# Altium schematic sheet Screen Driver.SchDoc: Graphics Driver PCB (part 1 of 3)
size A4; CompanyName: Concordia FSAE; DrawnBy: Ricky Lopez
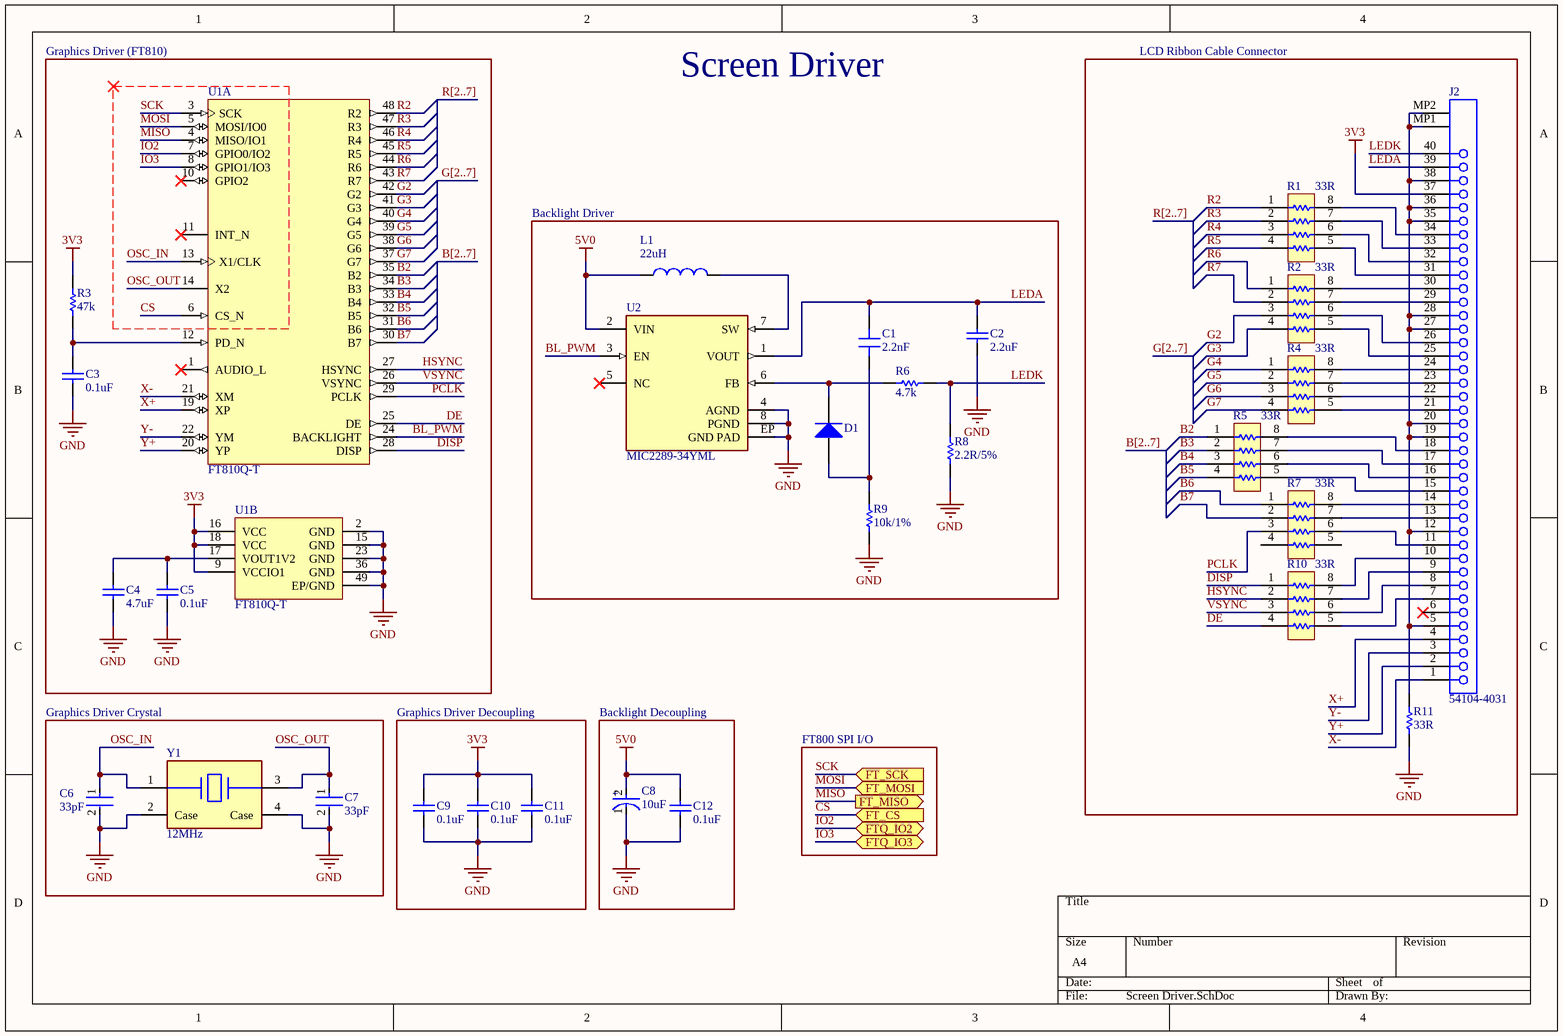
[diagram p0: Screen Driver.SchDoc]

## Parts
C1  2.2nF  [0805]
C2  2.2uF  [CAPC3225X270X30ML30]
C3  0.1uF  [CAPC2013X88X50NL20T25]
C4  4.7uF  [CAPC2113X120X50LL20T30]
C5  0.1uF  [CAPC2013X88X50NL20T25]
C6  33pF  [FP-CL21-IPC_B]
C7  33pF  [FP-CL21-IPC_B]
C8  10uF  [FP-T491C-MFG]
C9  0.1uF  [CAPC2013X88X50NL20T25]
C10  0.1uF  [CAPC2013X88X50NL20T25]
C11  0.1uF  [CAPC2013X88X50NL20T25]
C12  0.1uF  [CAPC2013X88X50NL20T25]
D1  1N4148WS-7-F  [DIOD-SOD323-2-A_V]  (value not drawn)
J2  54104-4031  [MOLX-54104-4031]
L1  22uH  [*INDC2012X145N]
R1  33R  [PNSC-EXB-38V103JV-8_M]
R2  33R  [PNSC-EXB-38V103JV-8_M]
R3  47k  [0805]
R4  33R  [PNSC-EXB-38V103JV-8_M]
R5  33R  [PNSC-EXB-38V103JV-8_M]
R6  4.7k  [0805]
R7  33R  [PNSC-EXB-38V103JV-8_M]
R8  2.2R/5%  [0805]
R9  10k/1%  [0805]
R10  33R  [PNSC-EXB-38V103JV-8_M]
R11  33R  [0805]
U1  FT810Q-T  [VQFN-48_5.2x5.2EP]  (parts A,B of 2)
U2  Part Number: MIC2289-34YML  [MIC2289]  (hidden comment: MIC2289)
Y1  12MHz  [FP-FL1200112-MFG]

## Blocks framed on the sheet
Graphics Driver (FT810): C3-C5 R3 U1
LCD Ribbon Cable Connector: J2 R1 R2 R4 R5 R7 R10 R11
Backlight Driver: C1 C2 D1 L1 R6 R8 R9 U2
Graphics Driver Crystal: C6 C7 Y1
Graphics Driver Decoupling: C9-C11
Backlight Decoupling: C8 C12

## Ports
FT_CS (in), FT_MISO (out), FT_MOSI (in), FT_SCK (in), FTQ_IO2 (bidir), FTQ_IO3 (bidir)

## Nets
3V3: C9.2 C10.2 C11.2 J2.37 R3.2 U1.9(VCCIO1) U1.16(VCC) U1.18(VCC)
5V0: C8.2(A) C12.2 L1.1 U2.2(VIN)
GND: C2.1 C3.1 C4.1 C5.1 C6.2 C7.2 C8.1(C) C9.1 C10.1 C11.1 C12.1 R8.2 R9.1 R11.1 U1.2(GND) U1.15(GND) U1.23(GND) U1.36(GND) U1.49(EP/GND) U2.4(AGND) U2.8(PGND) U2.EP(GND_PAD) Y1.2(Case) Y1.4(Case)
B2: R5.1 U1.35(B2)
B3: R5.2 U1.34(B3)
B4: R5.3 U1.33(B4)
B5: R5.4 U1.32(B5)
B6: R7.1 U1.31(B6)
B7: R7.2 U1.30(B7)
BL_PWM: U1.24(BACKLIGHT) U2.3(EN)
CS: U1.6(CS_N) ; port FT_CS
DE: R10.4 U1.25(DE)
DISP: R10.1 U1.28(DISP)
G2: R2.3 U1.42(G2)
G3: R2.4 U1.41(G3)
G4: R4.1 U1.40(G4)
G5: R4.2 U1.39(G5)
G6: R4.3 U1.38(G6)
G7: R4.4 U1.37(G7)
HSYNC: R10.2 U1.27(HSYNC)
IO2: U1.7(GPIO0/IO2) ; port FTQ_IO2
IO3: U1.8(GPIO1/IO3) ; port FTQ_IO3
LEDA: C1.2 C2.2 J2.39 U2.1(VOUT)
LEDK: J2.40 R6.1 R8.1
MISO: U1.4(MISO/IO1) ; port FT_MISO
MOSI: U1.5(MOSI/IO0) ; port FT_MOSI
OSC_IN: C6.1 U1.13(X1/CLK) Y1.1(1_Xtal)
OSC_OUT: C7.1 U1.14(X2) Y1.3(2_Xtal)
PCLK: R7.3 U1.29(PCLK)
R2: R1.1 U1.48(R2)
R3: R1.2 U1.47(R3)
R4: R1.3 U1.46(R4)
R5: R1.4 U1.45(R5)
R6: R2.1 U1.44(R6)
R7: R2.2 U1.43(R7)
SCK: U1.3(SCK) ; port FT_SCK
VSYNC: R10.3 U1.26(VSYNC)
X+: J2.4 U1.19(XP)
X-: J2.1 U1.21(XM)
Y+: J2.2 U1.20(YP)
Y-: J2.3 U1.22(YM)
NetC1_1: C1.1 D1.1(A) R9.2
NetC3_2: C3.2 R3.1 U1.12(PD_N)
NetC4_2: C4.2 C5.2 U1.17(VOUT1V2)
NetD1_2: D1.2(K) R6.2 U2.6(FB)
NetJ2_5: J2.5 J2.12 J2.19 J2.20 J2.27 J2.28 J2.35 J2.36 J2.38 J2.MP1 J2.MP2 R11.2
NetJ2_7: J2.7 R10.5
NetJ2_8: J2.8 R10.6
NetJ2_9: J2.9 R10.7
NetJ2_10: J2.10 R10.8
NetJ2_11: J2.11 R7.6
NetJ2_13: J2.13 R7.7
NetJ2_14: J2.14 R7.8
NetJ2_15: J2.15 R5.5
NetJ2_16: J2.16 R5.6
NetJ2_17: J2.17 R5.7
NetJ2_18: J2.18 R5.8
NetJ2_21: J2.21 R4.5
NetJ2_22: J2.22 R4.6
NetJ2_23: J2.23 R4.7
NetJ2_24: J2.24 R4.8
NetJ2_25: J2.25 R2.5
NetJ2_26: J2.26 R2.6
NetJ2_29: J2.29 R2.7
NetJ2_30: J2.30 R2.8
NetJ2_31: J2.31 R1.5
NetJ2_32: J2.32 R1.6
NetJ2_33: J2.33 R1.7
NetJ2_34: J2.34 R1.8
NetL1_2: L1.2 U2.7(SW)

Not connected (* = marked no-connect by the designer): J2 6*; R7 4 5; U1 1(AUDIO_L)* 10(GPIO2)* 11(INT_N)*; U2 5(NC)*

## Buses and harness runs
bus B[2..7]
bus G[2..7]
bus R[2..7]

## Notes on the sheet
- Screen Driver
- FT800 SPI I/O
- (in symbol CMP-03017-000001-1) +